# Altium schematic sheet Sheet2.SchDoc
size A4
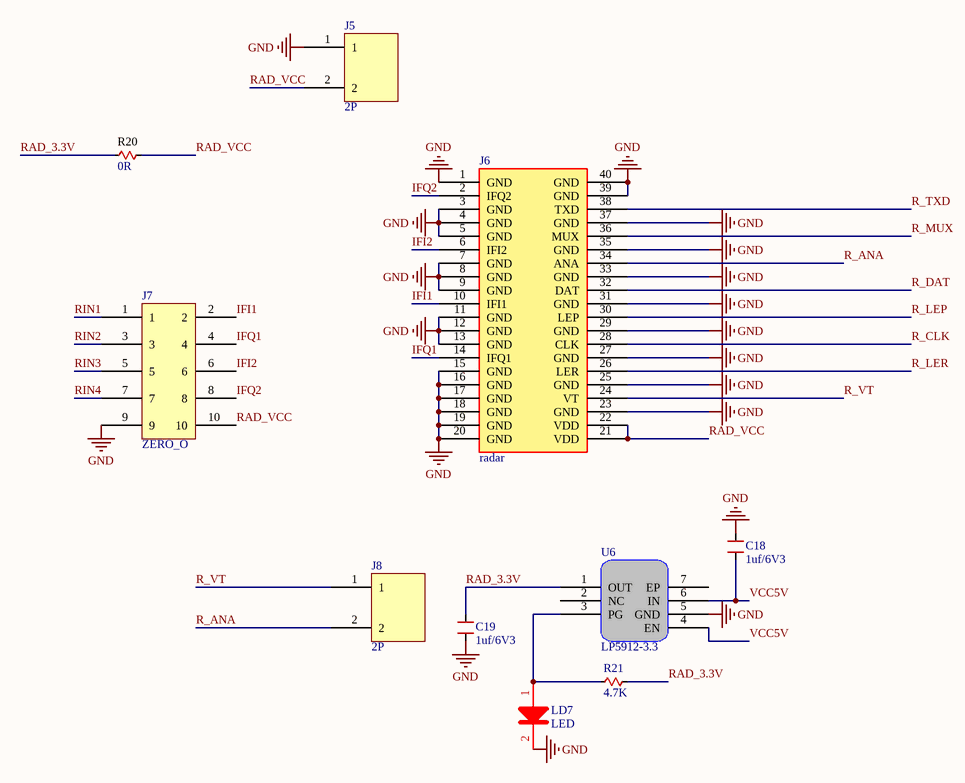
[diagram p0: Sheet2.SchDoc]

## Parts
C18  1uf/6V3  [CAP0603]
C19  1uf/6V3  [CAP0603]
J5  2P  [2P]
J6  radar  [BTB_40P_0.8_G]
J7  ZERO_O  [2*5P]
J8  2P  [2P]
LD7  LED  [0603D]
R20  0R  [R0603]
R21  4.7K  [R0603]
U6  LP5912-3.3  [WSON-6_L2.0-W2.0-P0.65-TL-EP]

## Nets
GND: C18.1 C19.2 J5.1 J6.1(GND) J6.3(GND) J6.4(GND) J6.5(GND) J6.7(GND) J6.8(GND) J6.9(GND) J6.11(GND) J6.12(GND) J6.13(GND) J6.15(GND) J6.16(GND) J6.17(GND) J6.18(GND) J6.19(GND) J6.20(GND) J6.23(GND) J6.25(GND) J6.27(GND) J6.29(GND) J6.31(GND) J6.33(GND) J6.35(GND) J6.37(GND) J6.39(GND) J6.40(GND) J7.9 LD7.2 U6.5(GND)
IFI1: J6.10(IFI1) J7.2
IFI2: J6.6(IFI2) J7.6
IFQ1: J6.14(IFQ1) J7.4
IFQ2: J6.2(IFQ2) J7.8
R_ANA: J6.34(ANA) J8.2
R_CLK: J6.28(CLK)
R_DAT: J6.32(DAT)
R_LEP: J6.30(LEP)
R_LER: J6.26(LER)
R_MUX: J6.36(MUX)
R_TXD: J6.38(TXD)
R_VT: J6.24(VT) J8.1
RAD_3.3V: C19.1 R20.1 R21.2 U6.1(OUT)
RAD_VCC: J5.2 J6.21(VDD) J6.22(VDD) J7.10 R20.2
RIN1: J7.1
RIN2: J7.3
RIN3: J7.5
RIN4: J7.7
VCC5V: C18.2 U6.4(EN) U6.6(IN)
NetLD7_1: LD7.1 R21.1 U6.3(PG)

Not connected (* = marked no-connect by the designer): U6 2(NC) 7(EP)

## Library data of the parts
C18 C19 = CAPACITOR_1UF: Generic Capacitor; Value: 4.7uF; DPN: *; Manufacturer: *
LD7 = LEDR
R20 = RESISTOR: Generic Resistor; Value: 390; Manufacturer: *; DPN: *
R21 = RESISTOR: Generic Resistor; Manufacturer: *; DPN: *; Value: 4.7K